# EAGLE design batboard (EAGLE 6.2)
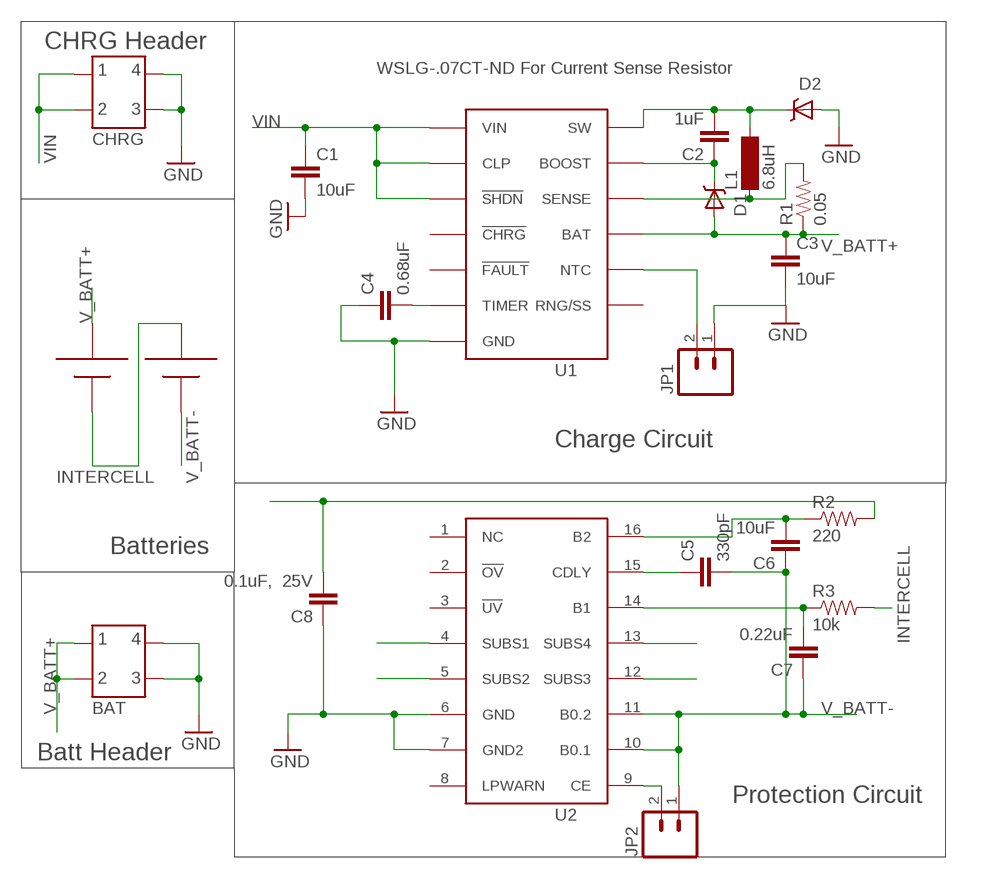
[diagram p0: schematic, sheet 1]

## Parts
BAT  C-GRID-71308  [4HEAD_MOLEX_C71308]
C1  10uF  CAP0805  [0805]
C2  1uF  CAP0805  [0805]
C3  10uF  CAP0805  [0805]
C4  0.68uF  CAP0805  [0805]
C5  330pF  CAP0805  [0805]
C6  10uF  CAP0805  [0805]
C7  0.22uF  CAP0805  [0805]
C8  0.1uF, 25V  CAP0805  [0805]
CHRG  C-GRID-71308  [4HEAD_MOLEX_C71308]
D1  DIODE-SCHOTTKY_  [SMA-DIODE]
D2  DIODE-SCHOTTKY_  [SMA-DIODE]
JP1  M02PTH  [1X02]
JP2  M02PTH  [1X02]
L1  6.8uH  SM-1206  [SM-1206]
R1  0.05  RESISTOR2512  [R2512]
R2  220  RESISTOR0603-RES  [0603-RES]
R3  10k  RESISTOR0603-RES  [0603-RES]
U1  LT3650  [12-MSOP]
U2  UCC3911  [SOIC-16]
U$1  BK-18650-PC4  [18650-PC4]

## Nets
GND: BAT.3 BAT.4 C1.2 C3.2 C4.1 C8.1 CHRG.3 CHRG.4 D2.A JP1.1 U1.GND U2.6(GND) U2.7(GND2)
HSINK: U2.4(SUBS1) U2.5(SUBS2) U2.12(SUBS3) U2.13(SUBS4)
INTERCELL: R3.2 U$1.+2 U$1.-1
N$1: JP2.2 U2.9(CE)
N$2: C2.1 D1.C U1.11(BOOST)
N$3: JP1.2 U1.8(NTC)
N$4: C4.2 U1.6(TIMER)
N$6: C2.2 D2.C L1.2 U1.12(SW)
N$7: L1.1 R1.2 U1.10(SENSE)
N$9: C5.1 U2.15(CDLY)
N$10: C6.2 R2.1 U2.16(B2)
N$13: C7.2 R3.1 U2.14(B1)
V_BATT+: BAT.1 BAT.2 C3.1 C8.2 D1.A R1.1 R2.2 U1.9(BAT) U$1.+1
V_BATT-: C5.2 C6.1 C7.1 JP2.1 U2.10(B0.1) U2.11(B0.2) U$1.-2
VIN: C1.1 CHRG.1 CHRG.2 U1.1(VIN) U1.2(CLP) U1.3(!SHDN)
Unconnected: U1.4(!CHRG) U1.5(!FAULT) U1.7(RNG/SS) U2.1(NC) U2.2(!OV) U2.3(!UV) U2.8(LPWARN)

## Notes on the sheet
- CHRG Header
- WSLG-.07CT-ND For Current Sense Resistor
- Charge Circuit
- Batteries
- Batt Header
- Protection Circuit

## Library data of the parts
BAT CHRG = jabinder:C-GRID-71308: 4 Pin SMT Molex HEADER Digikey: WM17450-ND
C1-C8 = SparkFun-Capacitors:CAP: Capacitor Standard 0603 ceramic capacitor, and 0.1" leaded capacitor.
D1 D2 = SparkFun-DiscreteSemi:DIODE-SCHOTTKY: Commonly MBRA140.
JP1 JP2 = SparkFun-Connectors:M02: Header 2 Standard 2-pin 0.1" header. Use with straight break away headers (SKU : PRT-00116), right angle break away headers (PRT-00553), swiss pins (PRT-00743), machine pins (PRT-00117), and female headers (PRT-00115). Molex polarized connector foot print use with SKU : PRT-08233 with associated crimp pins and housings.
L1 = inductor-neosid:SM-1206: INDUCTOR SMD chip inductor; OC_FARNELL: unknown; OC_NEWARK: unknown
R1-R3 = SparkFun-Passives:RESISTOR: Resistor Basic schematic elements and footprints for 0603, 1206, and PTH resistors.
U1 = jabinder:LT3650: A monolithic two cell lithium ion charger.
U2 = jabinder:UCC3911
U$1 = jabinder:BK-18650-PC4

## Board
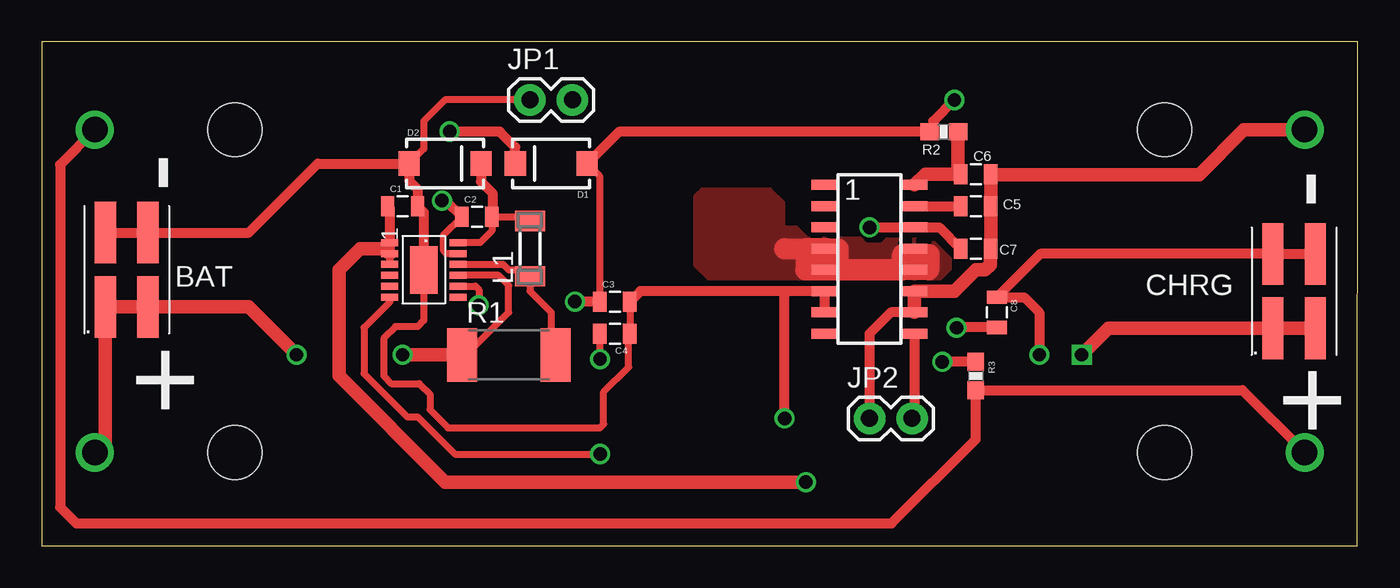
[diagram p1: board, top side]
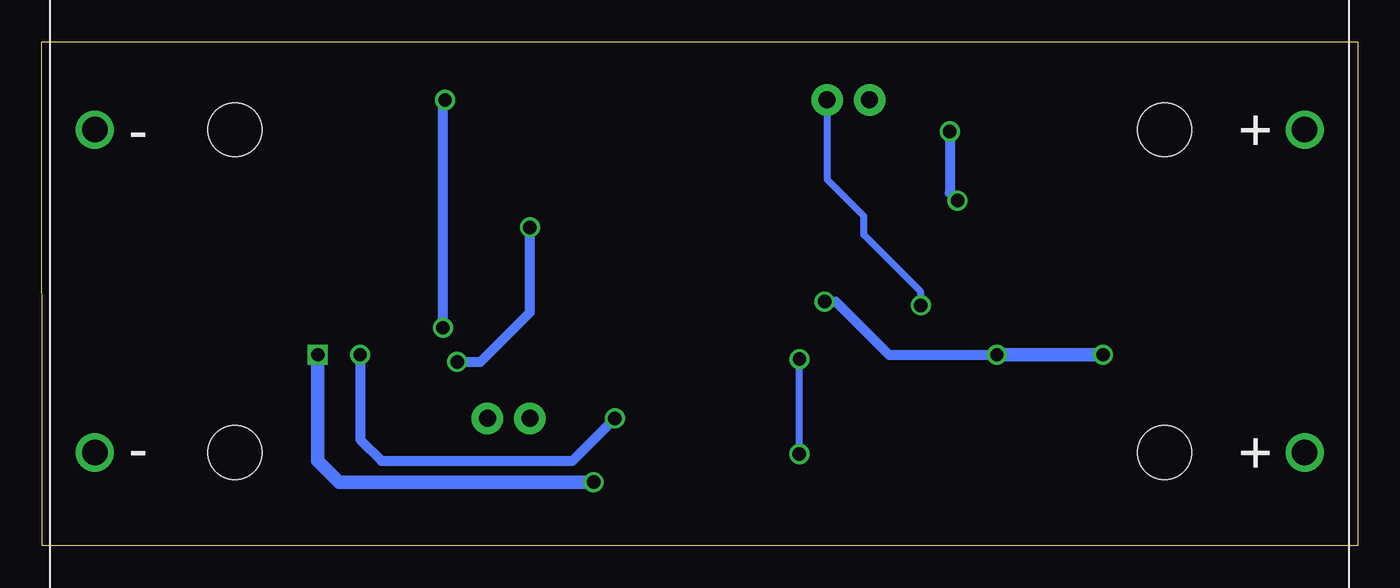
[diagram p2: board, bottom side, seen from below]

Size 78.74 x 30.15 mm. Coordinates in mm from the lower left corner, seen from the top.
Outline: 0,0 78.72,0 78.74,30.15 0,30.15 0,0
Copper layers (1*16): Top 0.0356mm / dielectric 1.5011mm / Bottom 0.0356mm
Design rules: minimum track width 6mil, minimum drill 13mil, track to track 6mil, track to pad 6mil, pad to pad 6mil, via to via 6mil, smd to smd 6mil, copper to edge 15mil, drill to drill 6mil, minimum pad ring 7mil, minimum via ring 7mil, stop-mask expansion 4mil, vias tented up to drill 0mil, thermal gap 10mil

### Footprints (pad centres in the part's own frame; a part is rotated, then mirrored left to right if it is on the bottom)
4HEAD_MOLEX_C71308 = smd 1.27 x 3.683: 1 -1.27,-2.223; 2 1.27,-2.223; 3 1.27,2.223; 4 -1.27,2.223
0805 = smd 0.8 x 1.2: 1 -0.9,0; 2 0.9,0
SMA-DIODE = smd 1.27 x 1.47: A -2.15,0; C 2.15,0
1X02 = drill 1.016 pad 1.88: 1 0,0; 2 2.54,0
SM-1206 = smd 1.2 x 1.8: 1 -1.65,0; 2 1.65,0
R2512 = smd 1.8 x 3.2: 1 -2.8,0; 2 2.8,0
0603-RES = smd 1.1 x 1: 1 -0.85,0; 2 0.85,0
12-MSOP = smd 0.419 x 1.016: 1 -1.626,-2.045; 2 -0.975,-2.045; 3 -0.325,-2.045; 4 0.325,-2.045; 5 0.975,-2.045; 6 1.626,-2.045; 7 1.626,2.045; 8 0.975,2.045; 9 0.325,2.045; 10 -0.325,2.045; 11 -0.975,2.045; 12 -1.626,2.045 | smd 2.845 x 1.651: GND 0,0
SOIC-16 = smd 0.6 x 1.55: 1 -3.81,-2.7; 2 -2.54,-2.7; 3 -1.27,-2.7; 4 0,-2.7; 5 1.27,-2.7; 6 2.54,-2.7; 7 3.81,-2.7; 8 5.08,-2.7; 9 5.08,2.7; 10 3.81,2.7; 11 2.54,2.7; 12 1.27,2.7; 13 0,2.7; 14 -1.27,2.7; 15 -2.54,2.7; 16 -3.81,2.7
18650-PC4 = drill 1.524: +1 -36.195,9.652; +2 -36.195,-9.652; -1 36.195,9.652; -2 36.195,-9.652 | hole 3.2: -27.813,9.652; -27.813,-9.652; 27.813,-9.652; 27.813,9.652

### Placement (x,y rotation side)
BAT  5.08,16.51 0 top
C1  21.59,20.32 0 top
C2  26.04,19.68 0 top
C3  34.29,14.6 0 top
C4  34.29,12.7 180 top
C5  55.88,20.32 0 top
C6  55.88,22.23 180 top
C7  55.88,17.78 180 top
C8  57.15,13.97 270 top
CHRG  74.93,15.24 0 top
D1  30.48,22.86 180 top
D2  24.13,22.86 0 top
JP1  29.21,26.67 0 top
JP2  49.53,7.62 0 top
L1  29.21,17.78 90 top
R1  27.94,11.43 0 top
R2  53.97,24.76 180 top
R3  55.88,10.16 270 top
U1  22.86,16.51 270 top
U2  49.53,17.78 270 top
U$1  39.37,15.24 180 bottom

### Tracks (layer width: path | path; a pad name or v marks a point on that pad's centre or on a via)
GND  (via drill 0.8)
  Top 0.406: U1.GND 22.86,13.48 22.5,13.12 21.17,13.12 20.46,12.41 20.46,10.16 20.91,9.71 22.59,9.71 23.22,9.07 23.22,8.14 24.31,7.06 33.4,7.06 33.62,7.28 33.62,9.2 35.11,10.69 35.11,12.62 C4.1 C3.2 | JP1.1 24.13,26.67 22.86,25.4 22.86,23.74 D2.A
  Top 0.61: BAT.4 BAT.3 12.38,18.73 16.51,22.86 D2.A 21.98,21.84 22.49,21.32 C1.2 22.86,19.95 U1.GND | CHRG.3 CHRG.4 59.74,17.46 C8.1 58.79,14.87 59.69,13.97 v59.69,11.43 | U2.7 U2.6 44.45,15.24 | 44.45,15.24 35.82,15.24 C3.2 | v44.45,7.62 44.45,15.24
  Bottom 0.61: v59.69,11.43 59.69,6.35 58.42,5.08 46.99,5.08 v44.45,7.62
HSINK
  Top 1.27: 46.99,16.51 46.99,17.78 U2.4 45.72,17.78 45.72,16.51 51.5,16.51 51.5,17.43 53.09,17.43 53.09,17.15 53.08,17.15 53.08,16.5 47.66,16.5 47.66,17.76 44.45,17.76 44.45,17.78
  pour Top: 44.45,19.05 45.12,19.05 45.78,18.39 48.95,18.39 49.3,18.04 50.29,18.04 50.6,18.35 53.16,18.35 54.31,17.2 54.31,16.55 53.73,15.97 39.91,15.97 39.12,16.76 39.12,20.93 39.52,21.33 43.55,21.33 44.34,20.55 44.34,19.12 44.41,19.04 44.44,19.04
INTERCELL
  Top 0.61: U$1.+2 1.09,22.81 1.09,2.32 2.07,1.34 50.85,1.34 55.88,6.37 R3.2 71.84,9.31 U$1.-1
N$1
  Top 0.61: U2.9 52.23,7.78 JP2.2
N$2  (via drill 0.8)
  Top 0.356: 24.18,17.48 24.03,17.64 24.03,18.58
  Top 0.406: U1.11 24.18,17.48 | 24.03,18.58 C2.1
  Top 0.61: D1.C 28.33,23.85 27.4,24.78 v24.41,24.78 | v23.94,20.65 24.17,20.65 C2.1
  Bottom 0.61: v24.41,24.78 24.41,21.12 v23.94,20.65
N$3  (via drill 0.8)
  Top 0.406: U1.8 25.94,15.54 26.16,15.32 26.16,14.4 v26.14,14.38
  Bottom 0.406: v26.14,14.38 26.14,15.19 29.55,18.6 29.55,19.72 31.74,21.91 31.74,26.66 JP1.2
N$4  (via drill 0.8)
  Top 0.406: U1.6 20.82,14.58 19.29,13.05 19.29,10.3 21.87,7.72 22.5,7.72 24.72,5.49 v33.41,5.49 | v33.4,11.17 C4.2
  Bottom 0.406: v33.41,5.49 33.41,11.16 v33.4,11.17
N$6
  Top 0.406: L1.2 28.96,19.68 C2.2 26.93,18.84 26.24,18.14 U1.12
  Top 0.61: D2.C 26.28,21.79 26.96,21.1 26.96,19.71 C2.2
N$7
  Top 0.406: U1.10 27.62,16.84 27.94,16.51 28.83,16.51 L1.1 29.21,15.24 30.48,13.97 30.48,11.69 R1.2
N$9
  Top 0.61: U2.15 C5.1
N$10
  Top 0.813: R2.1 54.82,22.38 C6.2 52.86,22.23 U2.16
N$13  (via drill 0.8)
  Top 0.61: C7.2 53.71,19.05 U2.14 v49.53,19.05 | R3.1 53.89,11.01 v53.88,11
  Bottom 0.61: v53.88,11 52.5,11 49.53,13.97 v49.53,19.05
V_BATT+  (via drill 0.8)
  Top 0.406: R1.1 25.4,11.43 27.94,13.97 27.94,15.58 27.34,16.18 U1.9 | C3.1 33.39,22.1 D1.A
  Top 0.61: C8.2 54.76,13.07 v54.73,13.05 | v54.61,26.67 53.34,25.4 53.34,24.98 R2.2 34.53,24.76 D1.A | C3.1 v31.9,14.6 v31.9,14.61
  Top 0.813: U$1.+1 3.81,6.22 BAT.1 BAT.2 12.38,14.29 v15.24,11.43 | v21.59,11.43 R1.1
  Bottom 0.61: v54.73,13.05 54.73,26.55 v54.61,26.67 | v31.9,14.61 31.22,14.61 28.04,11.43 v21.59,11.43
  Bottom 0.813: v15.24,11.43 v21.59,11.43
V_BATT-
  Top 0.61: U2.10 50.8,13.97 49.53,12.7 JP2.1
  Top 0.813: U$1.-2 71.93,24.89 69.25,22.21 56.8,22.21 C6.1 C5.2 C7.1 56.75,17.76 56.75,16.82 56.44,16.51 55.88,16.51 54.61,15.24 U2.11 U2.10
VIN  (via drill 0.8)
  Top 0.406: U1.2 U1.3
  Top 0.61: C1.1 20.82,20.2 U1.1 U1.2
  Top 0.813: CHRG.2 CHRG.1 63.82,13.02 v62.23,11.43 | v45.72,3.81 24.13,3.81 17.78,10.16 17.78,16.51 19.05,17.78 20.52,17.78 U1.2
  Bottom 0.813: v45.72,3.81 60.96,3.81 62.23,5.08 v62.23,11.43

### Text on the board
tPlace: - | - | + | +